# Altium schematic sheet Notes.SchDoc
size A4; SheetNumber: 1; SheetTotal: 10
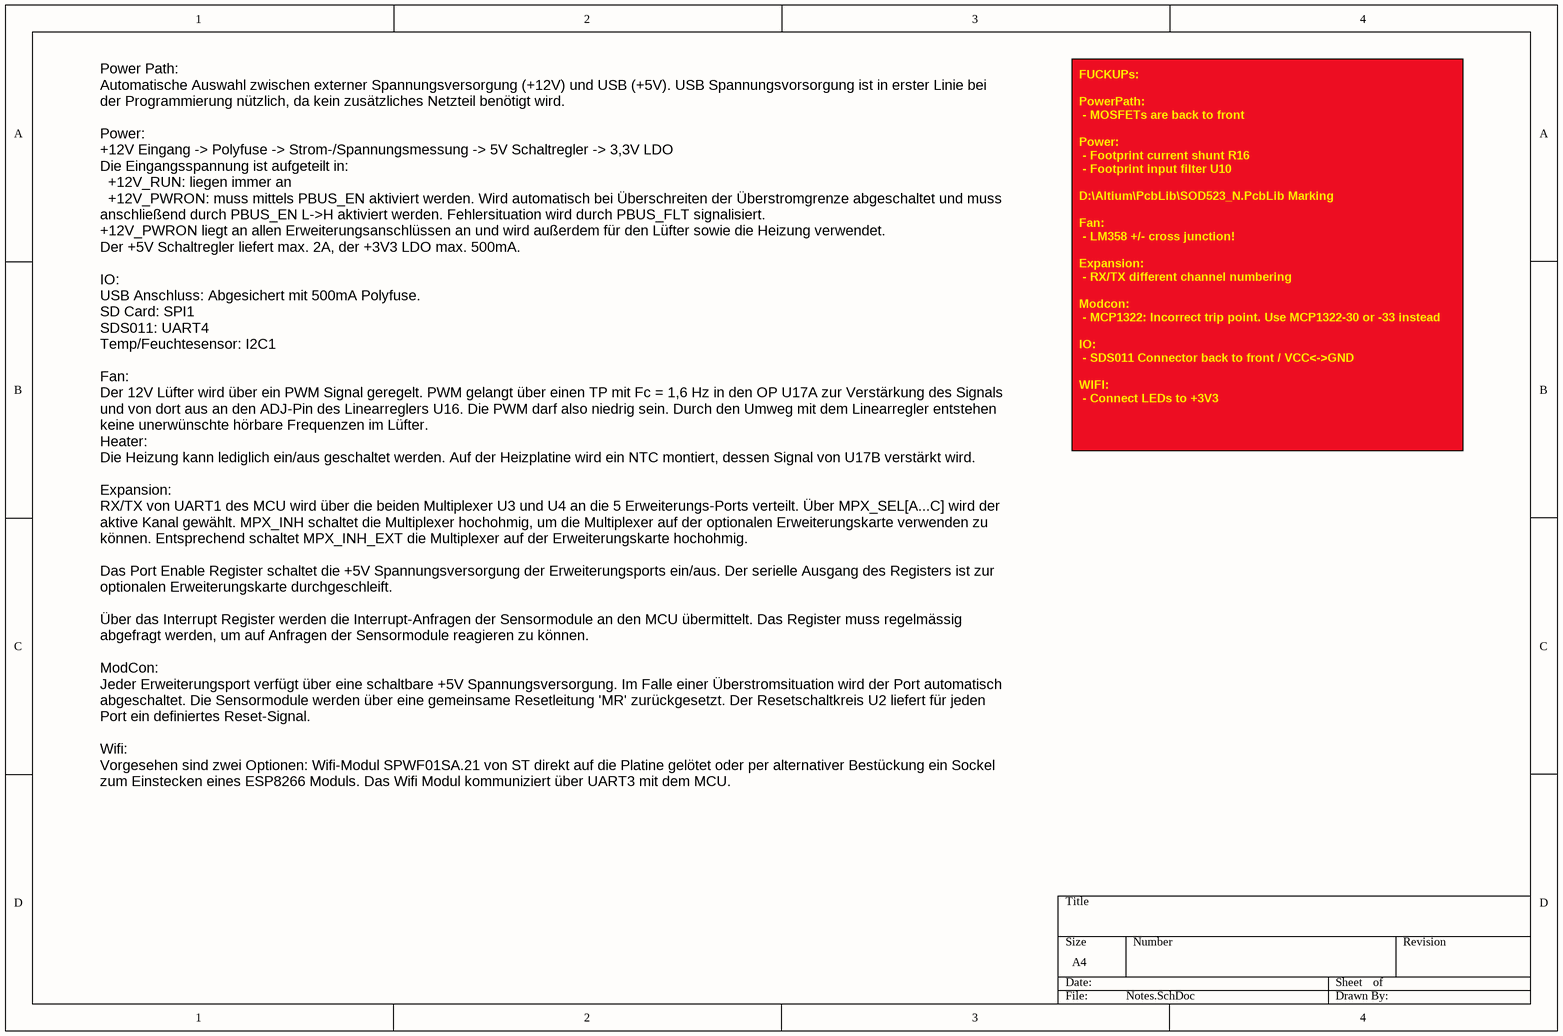
[diagram p0: Notes.SchDoc]

## Notes on the sheet
- FUCKUPs:
  PowerPath:
  - MOSFETs are back to front
  Power:
  - Footprint current shunt R16
  - Footprint input filter U10
  D:\Altium\PcbLib\SOD523_N.PcbLib Marking
  Fan:
  - LM358 +/- cross junction!
  Expansion:
  - RX/TX different channel numbering
  Modcon:
  - MCP1322: Incorrect trip point. Use MCP1322-30 or -33 instead
  IO:
  - SDS011 Connector back to front / VCC<->GND
  WIFI:
  - Connect LEDs to +3V3
- Power Path:
  Automatische Auswahl zwischen externer Spannungsversorgung (+12V) und USB (+5V). USB Spannungsvorsorgung ist in erster Linie bei der Programmierung nützlich, da kein zusätzliches Netzteil benötigt wird.
  Power:
  +12V Eingang -> Polyfuse -> Strom-/Spannungsmessung -> 5V Schaltregler -> 3,3V LDO
  Die Eingangsspannung ist aufgeteilt in:
  +12V_RUN: liegen immer an
  +12V_PWRON: muss mittels PBUS_EN aktiviert werden. Wird automatisch bei Überschreiten der Überstromgrenze abgeschaltet und muss anschließend durch PBUS_EN L->H aktiviert werden. Fehlersituation wird durch PBUS_FLT signalisiert.
  +12V_PWRON liegt an allen Erweiterungsanschlüssen an und wird außerdem für den Lüfter sowie die Heizung verwendet.
  Der +5V Schaltregler liefert max. 2A, der +3V3 LDO max. 500mA.
  IO:
  USB Anschluss: Abgesichert mit 500mA Polyfuse.
  SD Card: SPI1
  SDS011: UART4
  Temp/Feuchtesensor: I2C1
  Fan:
  Der 12V Lüfter wird über ein PWM Signal geregelt. PWM gelangt über einen TP mit Fc = 1,6 Hz in den OP U17A zur Verstärkung des Signals und von dort aus an den ADJ-Pin des Linearreglers U16. Die PWM darf also niedrig sein. Durch den Umweg mit dem Linearregler entstehen keine unerwünschte hörbare Frequenzen im Lüfter.
  Heater:
  Die Heizung kann lediglich ein/aus geschaltet werden. Auf der Heizplatine wird ein NTC montiert, dessen Signal von U17B verstärkt wird.
  Expansion:
  RX/TX von UART1 des MCU wird über die beiden Multiplexer U3 und U4 an die 5 Erweiterungs-Ports verteilt. Über MPX_SEL[A...C] wird der aktive Kanal gewählt. MPX_INH schaltet die Multiplexer hochohmig, um die Multiplexer auf der optionalen Erweiterungskarte verwenden zu können. Entsprechend schaltet MPX_INH_EXT die Multiplexer auf der Erweiterungskarte hochohmig.
  Das Port Enable Register schaltet die +5V Spannungsversorgung der Erweiterungsports ein/aus. Der serielle Ausgang des Registers ist zur optionalen Erweiterungskarte durchgeschleift.
  Über das Interrupt Register werden die Interrupt-Anfragen der Sensormodule an den MCU übermittelt. Das Register muss regelmässig abgefragt werden, um auf Anfragen der Sensormodule reagieren zu können.
  ModCon:
  Jeder Erweiterungsport verfügt über eine schaltbare +5V Spannungsversorgung. Im Falle einer Überstromsituation wird der Port automatisch abgeschaltet. Die Sensormodule werden über eine gemeinsame Resetleitung 'MR' zurückgesetzt. Der Resetschaltkreis U2 liefert für jeden Port ein definiertes Reset-Signal.
  Wifi:
  Vorgesehen sind zwei Optionen: Wifi-Modul SPWF01SA.21 von ST direkt auf die Platine gelötet oder per alternativer Bestückung ein Sockel zum Einstecken eines ESP8266 Moduls. Das Wifi Modul kommuniziert über UART3 mit dem MCU.